# EAGLE design cc2650_simplified (EAGLE 8.3.2)
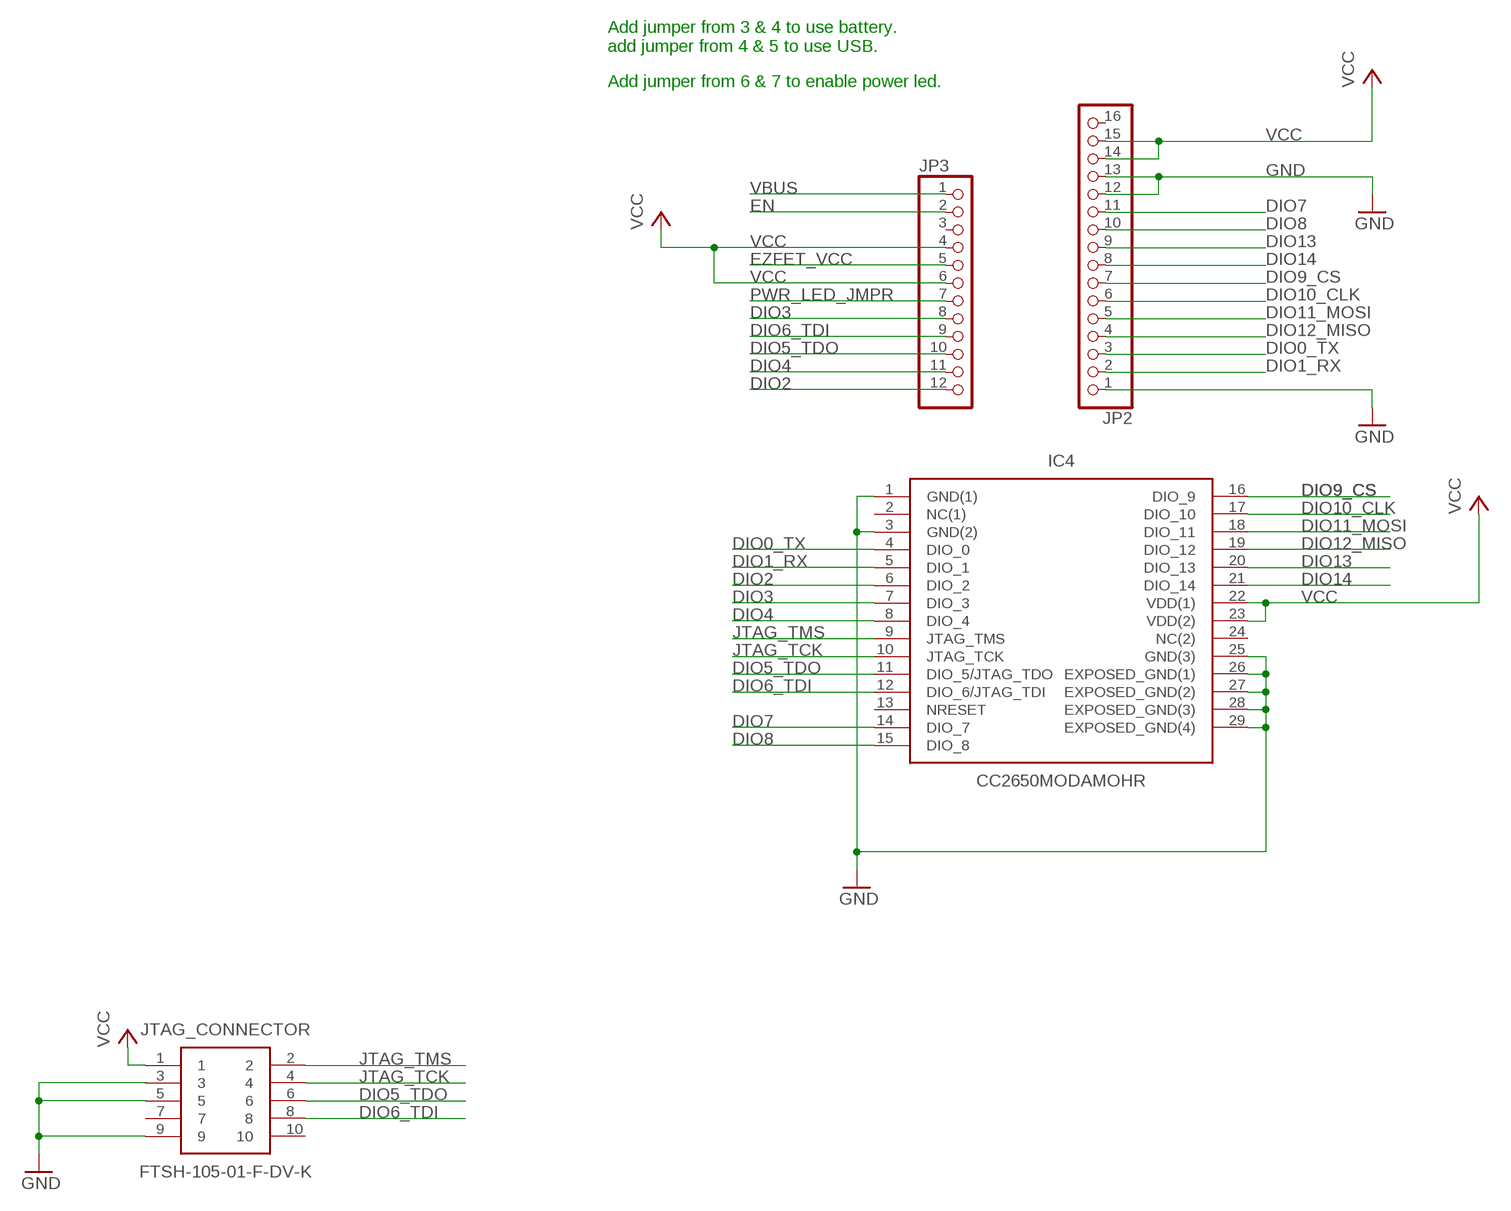
[diagram p0: schematic, sheet 1, part 1 of 2]
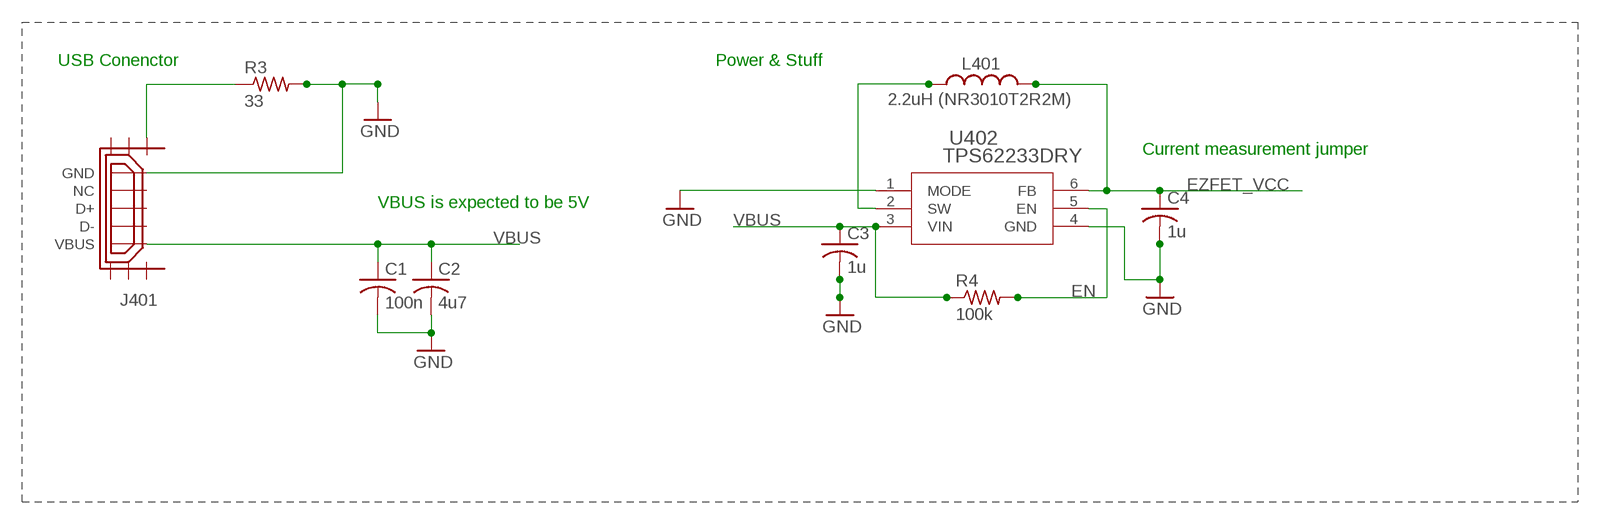
[diagram p1: schematic, sheet 1, part 2 of 2]

## Parts
C1  100n  C-USC0402  [C0402]
C2  4u7  C-USC1206  [C1206]
C3  1u  C-USC0805  [C0805]
C4  1u  C-USC0805  [C0805]
IC4  CC2650MODAMOHR  [MOH0029A]
J401  USB_MICRO_FLIPPED  [HIROSE-ZX62R-B-5P]
JP2  HEADER-1X16ROUND  [1X16_ROUND]
JP3  HEADER-1X12  [1X12_ROUND]
JTAG_CONNECTOR  FTSH-105-01-F-DV-K  [SAMTEC_FTSH-105-01-L-DV]
L401  2.2uH (NR3010T2R2M)  L-NR3010  [L-NR3010]
R3  33  R-US_R0402  [R0402]
R4  100k  R-US_R0603  [R0603]
U402  TPS62233DRY  TPS6223X_DRY_6  [DRY6]

## Nets
DIO0_TX: IC4.4(DIO_0) JP2.3
DIO1_RX: IC4.5(DIO_1) JP2.2
DIO2: IC4.6(DIO_2) JP3.12
DIO3: IC4.7(DIO_3) JP3.8
DIO4: IC4.8(DIO_4) JP3.11
DIO5_TDO: IC4.11(DIO_5/JTAG_TDO) JP3.10 JTAG_CONNECTOR.6
DIO6_TDI: IC4.12(DIO_6/JTAG_TDI) JP3.9 JTAG_CONNECTOR.8
DIO7: IC4.14(DIO_7) JP2.11
DIO8: IC4.15(DIO_8) JP2.10
DIO9_CS: IC4.16(DIO_9) JP2.7
DIO10_CLK: IC4.17(DIO_10) JP2.6
DIO11_MOSI: IC4.18(DIO_11) JP2.5
DIO12_MISO: IC4.19(DIO_12) JP2.4
DIO13: IC4.20(DIO_13) JP2.9
DIO14: IC4.21(DIO_14) JP2.8
EN: JP3.2 R4.2 U402.5(EN)
EZFET_VCC: C4.1 JP3.5 L401.P$2 U402.6(FB)
GND: C1.2 C2.2 C3.2 C4.2 IC4.1(GND(1)) IC4.3(GND(2)) IC4.25(GND(3)) IC4.26(EXPOSED_GND(1)) IC4.27(EXPOSED_GND(2)) IC4.28(EXPOSED_GND(3)) IC4.29(EXPOSED_GND(4)) J401.GND JP2.1 JP2.12 JP2.13 JTAG_CONNECTOR.3 JTAG_CONNECTOR.5 JTAG_CONNECTOR.9 R3.2 U402.1(MODE) U402.4(GND)
JTAG_TCK: IC4.10(JTAG_TCK) JTAG_CONNECTOR.4
JTAG_TMS: IC4.9(JTAG_TMS) JTAG_CONNECTOR.2
N$1: J401.SHIELD1 R3.1
N$14: L401.P$1 U402.2(SW)
PWR_LED_JMPR: JP3.7
VBUS [Power]: C1.1 C2.1 C3.1 J401.VBUS JP3.1 R4.1 U402.3(VIN)
VCC: IC4.22(VDD(1)) IC4.23(VDD(2)) JP2.14 JP2.15 JP3.4 JP3.6 JTAG_CONNECTOR.1
Unconnected: IC4.2(NC(1)) IC4.13(NRESET) IC4.24(NC(2)) J401.D+ J401.D- J401.NC J401.SHIELD2 J401.SHIELD3 J401.SHIELD4 J401.SHIELD5 J401.SHIELD6 JP2.16 JP3.3 JTAG_CONNECTOR.7 JTAG_CONNECTOR.10

## Notes on the sheet
- Add jumper from 3 & 4 to use battery.
  add jumper from 4 & 5 to use USB.
- Add jumper from 6 & 7 to enable power led.
- USB Conenctor | Power & Stuff
- Current measurement jumper
- VBUS is expected to be 5V

## Library data of the parts
C1 = adafruit:C-US: CAPACITOR, American symbol; MPN: C1005X7R1H104K050BB; OC_NEWARK: 04X3230
C2 = adafruit:C-US: CAPACITOR, American symbol; MPN: GRT31CC81E475KE01L; OC_NEWARK: 01AC8998
C3 C4 = adafruit:C-US: CAPACITOR, American symbol; MPN: C0805C105K5RACTU; OC_NEWARK: 05AC8016
IC4 = CC2650MODAMOHR(2):CC2650MODAMOHR: SimpleLink Bluetooth low energy Wireless MCU Module <https://componentsearchengine.com/Images/9/CC2650MODAMOHR.jpg> Source: Datasheet <http://www.ti.com/lit/gpn/cc2650moda>; DESCRIPTION: SimpleLink Bluetooth low energy Wireless MCU Module; HEIGHT: mm; MANUFACTURER_NAME: Texas Instruments; MANUFACTURER_PART_NUMBER: CC2650MODAMOHR; MPN: CC2650MODAMOHR; OC_NEWARK: 02AC9626; SUPPLIER_NAME: RS
J401 = usb_con-update:USB_MICRO_FLIPPED; MPN: ZX62R-B-5P(30); OC_NEWARK: 84Y6712
JP2 = microbuilder:HEADER-1X16: PIN HEADER; OC_NEWARK: unknown
JP3 = microbuilder:HEADER-1X12; OC_NEWARK: unknown
JTAG_CONNECTOR = FTSH-105-01-F-DV-K:FTSH-105-01-F-DV-K: .050 x .050 CL DOUBLE VERTICAL SMT TERMINAL STRIP <https://componentsearchengine.com/Images/9/FTSH-105-01-F-DV-K.jpg> Source: Datasheet <http://suddendocs.samtec.com/prints/ftsh-1xx-xx-xxx-dv-xxx-xxx-mkt.pdf>; DESCRIPTION: .050 x .050 CL DOUBLE VERTICAL SMT TERMINAL STRIP; HEIGHT: mm; MANUFACTURER_NAME: SAMTEC; MANUFACTURER_PART_NUMBER: FTSH-105-01-F-DV-K; MPN: FTSH-105-01-F-DV-K; OC_NEWARK: 45P5160; SUPPLIER_NAME: RS
L401 = MSP-EXP430F5659:L-NR3010; MPN: NR3010T2R2M; OC_NEWARK: 87K4752
R3 = adafruit:R-US_: RESISTOR, American symbol; MPN: ERJ-U02F33R0X; OC_NEWARK: 51W3197
R4 = adafruit:R-US_: RESISTOR, American symbol; MPN: RC0603JR-07100KL; OC_NEWARK: 68R0147
U402 = tps62231dry:TPS6223X_DRY_6; DATASHEETURL: http://www.ti.com/lit/gpn/TPS62231; DESCRIPTION: 3 MHz Ultra Small Step Down Converter in 1x1.5 SON Package; FAMILY_NAME: STEP-DOWN REGULATOR; GENERIC_PART_NUMBER: TPS62231; INDUSTRY_STD_PKG_TYPE: SON; MANUFACTURER: Texas Instruments; MANUFACTURER_PART_NUMBER: tps62231_dry_6; MPN: TPS62233DRYT; OC_NEWARK: 37X8886; PACKAGE_DESIGNATOR: DRY; PIN_COUNT: 6; VALUE: TPS6223xDRY; VENDOR: Texas Instuments

## Net classes
0 Default: width 0.203 mm, drill 0.305 mm, clearance 0.152 mm
1 Ground: width 0.203 mm, drill 0.305 mm, clearance 0.152 mm to class 0, clearance 0.152 mm
2 Power: width 0.203 mm, drill 0.305 mm, clearance 0.152 mm to class 0, clearance 0.152 mm to class 1, clearance 0.152 mm

## Board
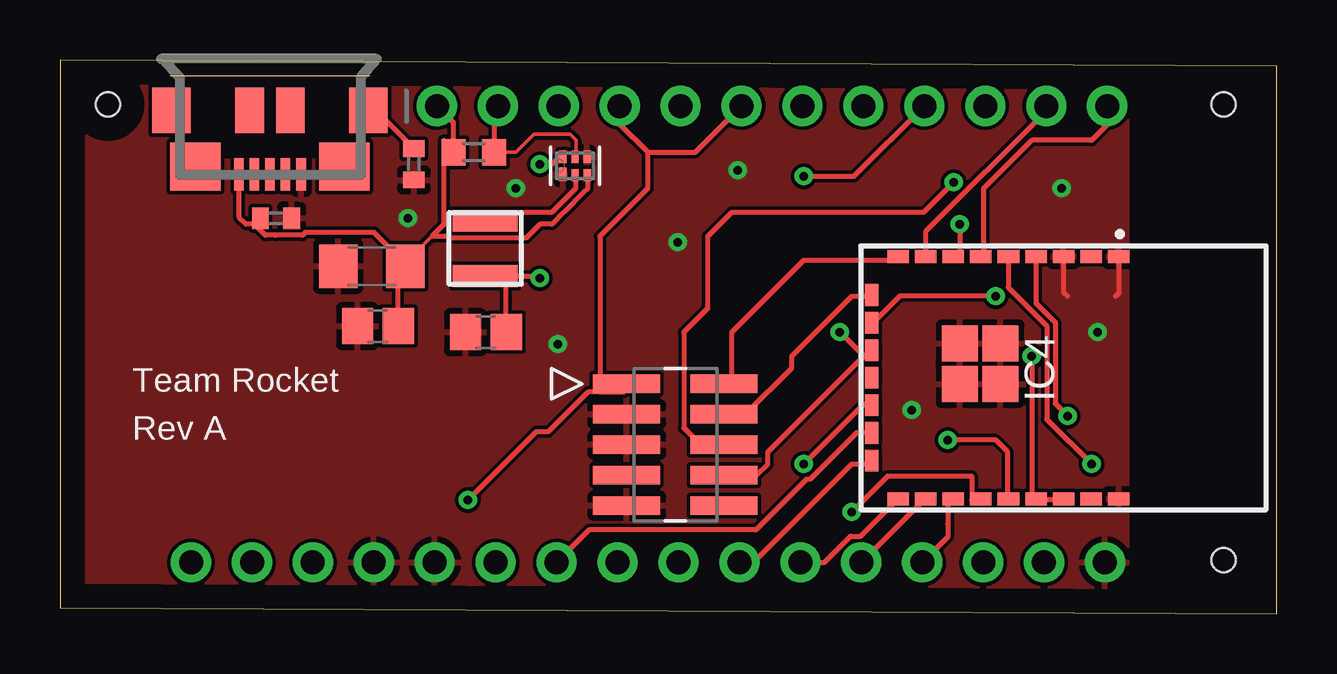
[diagram p2: board, top side]
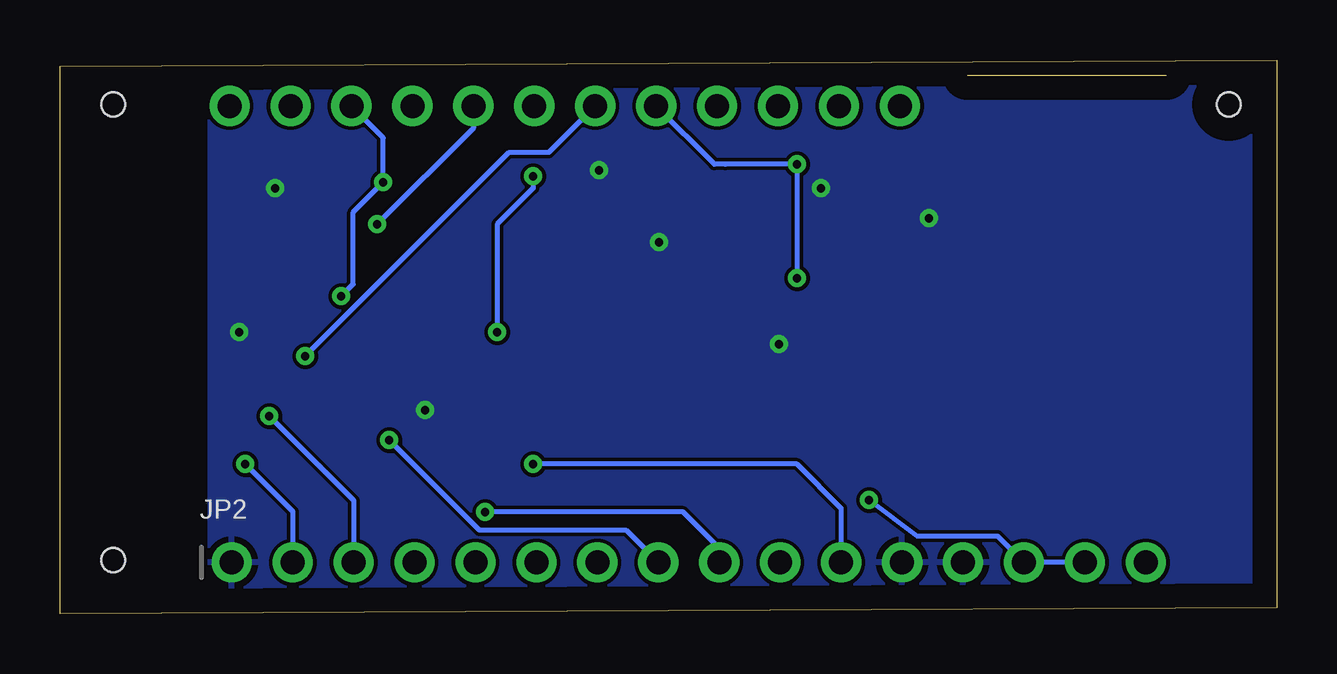
[diagram p3: board, bottom side, seen from below]

Size 50.72 x 23.1 mm. Coordinates in mm from the lower left corner, seen from the top.
Outline: 0,0.25 50.72,0 50.72,22.85 0,23.1 0,0.25
Copper layers (1*16): Top 0.035mm / dielectric 1.5mm / Bottom 0.035mm
Design rules "default": minimum track width 6mil, minimum drill 0.35mm, track to track 6mil, track to pad 6mil, pad to pad 6mil, via to via 6mil, smd to smd 6mil, copper to edge 40mil, drill to drill 6mil, minimum pad ring 10mil, minimum via ring 8mil, stop-mask expansion 4mil, vias tented up to drill 0mil, thermal gap 10mil
Holes 1 mm at 48.5,2.25 48.5,21.25 2,21.25

### Footprints (pad centres in the part's own frame; a part is rotated, then mirrored left to right if it is on the bottom)
C0402 = smd 0.7 x 0.9: 1 -0.65,0; 2 0.65,0
C1206 = smd 1.6 x 1.8: 1 -1.4,0; 2 1.4,0
C0805 = smd 1.3 x 1.5: 1 -0.85,0; 2 0.85,0
MOH0029A = smd 0.55 x 0.9: 1 -5.05,-6.15; 2 -5.05,-7.3; 3 -5.05,-8.45; 4 -5.05,-9.6; 5 -5.05,-10.75; 6 -5.05,-11.9; 7 -5.05,-13.05; 8 -5.05,-14.2; 9 -5.05,-15.35; 17 5.05,-15.35; 18 5.05,-14.2; 19 5.05,-13.05; 20 5.05,-11.9; 21 5.05,-10.75; 22 5.05,-9.6; 23 5.05,-8.45; 24 5.05,-7.3; 25 5.05,-6.15 | smd 0.9 x 0.55: 10 -3.45,-16.45; 11 -2.3,-16.45; 12 -1.15,-16.45; 13 0,-16.45; 14 1.15,-16.45; 15 2.3,-16.45; 16 3.45,-16.45 | smd 1.5 x 1.5: 26 -1.435,-11.075; 27 -1.435,-12.775; 28 0.265,-12.775; 29 0.265,-11.075
HIROSE-ZX62R-B-5P = smd 1.35 x 0.4: D+ 2.675,0; D- 2.675,-0.65; GND 2.675,1.3; NC 2.675,0.65; VBUS 2.675,-1.3 | smd 1.9 x 1.6: SHIELD1 0,4.1; SHIELD2 0,-4.1 | smd 2 x 2.1: SHIELD3 2.35,3.1; SHIELD4 2.35,-3.1 | smd 1.9 x 1.2: SHIELD5 0,0.85; SHIELD6 0,-0.85
1X16_ROUND = drill 1 pad 1.676: 1 -19.05,0; 2 -16.51,0; 3 -13.97,0; 4 -11.43,0; 5 -8.89,0; 6 -6.35,0; 7 -3.81,0; 8 -1.27,0; 9 1.27,0; 10 3.81,0; 11 6.35,0; 12 8.89,0; 13 11.43,0; 14 13.97,0; 15 16.51,0; 16 19.05,0
1X12_ROUND = drill 1 pad 1.676: 1 -13.97,0; 2 -11.43,0; 3 -8.89,0; 4 -6.35,0; 5 -3.81,0; 6 -1.27,0; 7 1.27,0; 8 3.81,0; 9 6.35,0; 10 8.89,0; 11 11.43,0; 12 13.97,0
SAMTEC_FTSH-105-01-L-DV = smd 0.762 x 2.794: 1 -2.54,-2.032; 2 -2.54,2.032; 3 -1.27,-2.032; 4 -1.27,2.032; 5 0,-2.032; 6 0,2.032; 7 1.27,-2.032; 8 1.27,2.032; 9 2.54,-2.032; 10 2.54,2.032
L-NR3010 = smd 0.9 x 2.7: P$1 -1.15,0; P$2 1.15,0
R0402 = smd 0.7 x 0.9: 1 -0.65,0; 2 0.65,0
R0603 = smd 1 x 1.1: 1 -0.85,0; 2 0.85,0
DRY6 = smd 0.559 x 0.305: 1 -0.356,0.508 | smd 0.508 x 0.305: 2 -0.381,0; 3 -0.381,-0.508; 4 0.381,-0.508; 5 0.381,0; 6 0.381,0.508

### Placement (x,y rotation side)
C1  9,16.5 0 top
C2  13,14.5 180 top
C3  13.25,12 180 top
C4  17.75,11.75 180 top
IC4  50.28,9.85 270 top
J401  8.75,21 270 top
JP2  24.51,2.15 0 bottom
JP3  29.68,21.18 0 top
JTAG_CONNECTOR  25.65,7.06 270 top
L401  17.72,15.24 270 top
R3  14.75,18.75 270 top
R4  17.25,19.25 0 top
U402  21.47,18.68 90 top

### Tracks (layer width: path | path; a pad name or v marks a point on that pad's centre or on a via)
DIO0_TX  (via drill 0.35)
  Top 0.2: IC4.4 40.68,12.96 41.48,12.16 41.48,8.77 v42,8.25
  Top 0.203: 41,14.75 IC4.4
  Bottom 0.2: v42,8.25 38.48,4.73 JP2.3
DIO1_RX  (via drill 0.35)
  Top 0.2: IC4.5 39.53,13.61 41.13,12.01 41.13,8.12 v43,6.25
  Top 0.203: 39.5,14.75 IC4.5
  Bottom 0.2: v43,6.25 41.02,4.27 JP2.2
DIO2
  Top 0.2: JP3.12 43.65,20.4 43,19.75 | 38.5,17.25 38.5,17.75 40,19.25
  Top 0.203: 38.5,17.25 38.5,14.75 IC4.6 | 43,19.75 40.5,19.75 40,19.25
DIO3  (via drill 0.35)
  Top 0.203: v37.5,16.25 37.5,14.75 IC4.7
  Bottom 0.2: JP3.8 33.49,20.26 v37.5,16.25
DIO4
  Top 0.2: IC4.8 36.08,15.94 41.11,20.97 JP3.11
  Top 0.203: 36,14.75 IC4.8
DIO5_TDO  (via drill 0.35)
  Top 0.2: 35.5,16.75 36,16.75 v37.25,18 | 27,15.25 27,15.75 28,16.75
  Top 0.203: v39,13.25 35,13.25 34,12.25 IC4.11 | 27,15.25 27,12.75 26,11.75 26,7.75 26.5,7.25 27.5,7.25 JTAG_CONNECTOR.6 | 28,16.75 35.5,16.75
  Bottom 0.2: 38.5,13.75 38.5,16.75 v37.25,18 37.25,19.86 JP3.10
  Bottom 0.203: v39,13.25 38.5,13.75
DIO6_TDI  (via drill 0.35)
  Top 0.2: JTAG_CONNECTOR.8 29.04,5.79 29.5,6.25 | v31,18.25 33.1,18.25 JP3.9
  Top 0.203: 33.5,10.75 34,10.75 IC4.12 | 33.5,10.75 29.5,6.75 29.5,6.25 | v32.5,11.75 33.5,10.75
  Bottom 0.203: v32.5,11.75 32.5,16.25 31,17.75 v31,18.25
DIO7  (via drill 0.35)
  Top 0.203: v31,6.25 33.5,8.75 34,8.75 IC4.14
  Bottom 0.2: 20,6.25 18.16,4.41 JP2.11
  Bottom 0.203: 20,6.25 v31,6.25
DIO8
  Top 0.2: IC4.15 33.19,7.55 31.26,5.62 31.12,5.62 29,3.5 22.05,3.5 JP2.10
  Top 0.203: 34,7.25 IC4.15
DIO9_CS
  Top 0.2: JP2.7 28.9,2.15 33,6.25 34,6.25
  Top 0.203: 34,6.25 IC4.16
DIO10_CLK
  Top 0.2: IC4.17 33.37,3.24 32.95,3.24 31.86,2.15 JP2.6
DIO11_MOSI
  Top 0.2: IC4.18 36.05,4.8 JP2.5
  Top 0.203: IC4.18 36,4.75
DIO12_MISO
  Top 0.2: 37,3.75 37,3.21 JP2.4
  Top 0.203: 37,3.75 37,4.75 IC4.19
DIO13  (via drill 0.35)
  Top 0.203: v33,4.25 34.5,5.75 38,5.75 38,4.75 IC4.20
  Bottom 0.2: JP2.9 23.24,2.74 24.75,4.25
  Bottom 0.203: 24.75,4.25 v33,4.25
DIO14  (via drill 0.35)
  Top 0.2: 39.5,6.25 39.5,6.75 39,7.25
  Top 0.203: 39.5,6.25 39.5,4.75 IC4.21 | 39,7.25 v37,7.25
  Bottom 0.2: 33.25,3.5 27.13,3.5 JP2.8
  Bottom 0.203: v37,7.25 33.25,3.5
EN
  Top 0.152: R4.2 19,19.25 19.75,20 21,20 | 21,20 21.25,20 | 21,20 21.25,20 | 21.25,20 21.5,19.75 21.5,19.09 U402.5
  Top 0.2: R4.2 18.1,21.03 JP3.2
EZFET_VCC  (via drill 0.35)
  Top 0.2: 19,14.09 L401.P$2 | 19,14.09 19.91,14.09 v20,14 | C4.1 18.6,13.69 19,14.09
  Top 0.203: 17,13.75 17.5,13.75 L401.P$2 | 20.5,18.75 21,19 | v20,18.75 20.5,18.75 | 20.5,18.75 21,19.25 U402.6
  Bottom 0.2: 23,18.75 23.44,18.75 JP3.5
  Bottom 0.203: 23,18.75 v20,18.75 v20,14
GND  (via drill 0.35)
  Top 0.2: IC4.3 41.83,13.42 42,13.25 | IC4.1 44.13,13.38 44,13.25
  other vias: 43.25,11.75 20.75,11.25 14.5,16.5 25.75,15.5 19,17.75 41.75,17.75 35.5,8.5 28.25,18.5
  pour Bottom: 0,23.25 44.5,23.25 44.5,0.25 0,0.25
  pour Top: 0,23.25 44.5,23.25 44.5,0.25 0,0.25
JTAG_TCK
  Top 0.2: JTAG_CONNECTOR.4 28.58,8.33 30.5,10.25
  Top 0.203: 30.5,10.25 30.5,10.75 33,13.25 34,13.25 IC4.10
JTAG_TMS
  Top 0.203: IC4.9 34.5,14.75 31,14.75 28,11.75 28,9.75 JTAG_CONNECTOR.2
N$1
  Top 0.2: J401.SHIELD1 13.15,21 R3.1
  Top 0.203: 13,21.75 J401.SHIELD1
N$14
  Top 0.2: 20,16.75 20.5,16.75 21.5,17.75
  Top 0.203: 21.5,17.75 21.5,18.25 U402.2 | 20,16.75 18,16.75 L401.P$1
VBUS
  Top 0.152: 15.5,15.75 14.38,14.62 14.25,14.5
  Top 0.2: 16,16.25 15.5,15.75 16.2,15.75 16.27,15.69 19.44,15.69 19.75,16 | 22,17.75 21.85,17.6 21,16.75 20.5,16.25 | C3.1 14.1,14.2 C2.1 14.25,14.5 | 14.38,14.62 13.1,15.9 10.21,15.9 10.11,15.8 9,15.8 | 9,15.8 8.95,15.8 | R4.1 16.4,20.49 JP3.1 | 8.1,16.25 7.75,16.25 7.45,16.55 J401.VBUS | 8.1,16.25 C1.1 | 9,15.8 8.55,15.8 8.1,16.25
  Top 0.203: 22,17.75 22,18.25 U402.3 | 20.5,16.25 20,16.25 19.75,16 | 16,16.25 16,19.75 R4.1
VCC  (via drill 0.35)
  Top 0.2: 21.5,8.75 20.35,7.6 19.85,7.6 v17,4.75 | JP3.4 23.33,20.42 24.5,19.25 26.48,19.25 JP3.6 | 23,16.25 22.5,15.75 22.5,9.25
  Top 0.203: 21.5,8.75 22,9.25 22.5,9.25 23.5,9.25 JTAG_CONNECTOR.1 | IC4.23 41.5,4.75 41,4.75 IC4.22 40.5,4.75 v40.5,10.75 | 22.75,16 23,16.25 24.5,17.75 24.5,19.25
  Bottom 0.2: v17,4.75 14.99,3.24 11.63,3.24 JP2.14 JP2.15 | v40.5,10.75 32,19.25 30.34,19.25 JP3.6

### Text on the board
tPlace: Team Rocket | Rev A